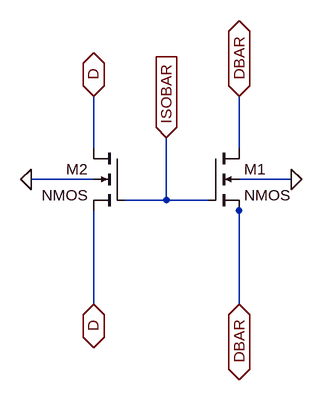
[diagram p0: schematic Isolation.asc]
Isolation.asc, the LTspice schematic file:
Version 4
SHEET 1 880 680
WIRE 48 128 48 48
WIRE 272 128 272 48
WIRE 48 176 -48 176
WIRE 352 176 272 176
WIRE 160 208 160 112
WIRE 160 208 96 208
WIRE 224 208 160 208
WIRE 272 224 272 208
WIRE 48 368 48 224
WIRE 272 368 272 224
FLAG 48 48 D
IOPIN 48 48 BiDir
FLAG 272 48 DBAR
IOPIN 272 48 BiDir
FLAG 272 368 DBAR
IOPIN 272 368 BiDir
FLAG 48 368 D
IOPIN 48 368 BiDir
FLAG 160 112 ISOBAR
IOPIN 160 112 In
FLAG 352 176 0
FLAG -48 176 0
SYMBOL nmos4 224 128 R0
SYMATTR InstName M1
SYMATTR Value2 l=0.6u w=3u
SYMBOL nmos4 96 128 M0
SYMATTR InstName M2
SYMATTR Value2 l=0.6u w=3u

The netlist it stands for:
* Isolation.asc
M1 DBAR ISOBAR DBAR 0 NMOS l=0.6u w=3u
M2 D ISOBAR D 0 NMOS l=0.6u w=3u
.model NMOS NMOS
.model PMOS PMOS
.lib standard.mos
.backanno
.end